# EAGLE design SilSpark (EAGLE 7.2.0)
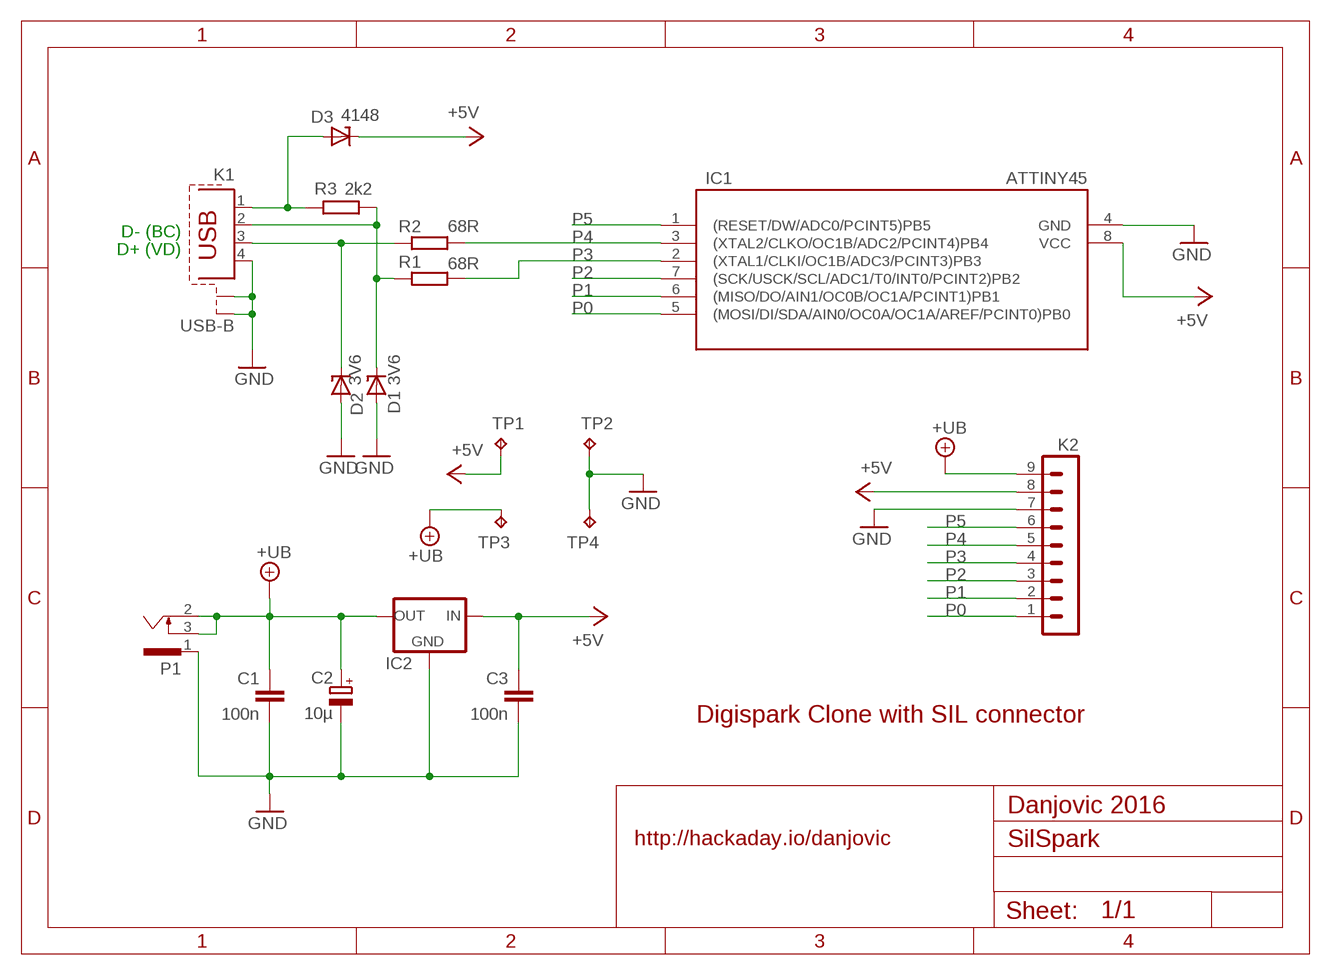
[diagram p0: schematic, sheet 1]

## Parts
C1  100n  C-EU050-025X075_LARGEPADS  [C050-025X075_LARGEPADS]
C2  10µ  CPOL-EUE2-4_LARGEPADS  [E2-4_LARGEPADS]
C3  100n  C-EU050-025X075_LARGEPADS  [C050-025X075_LARGEPADS]
D1  3V6  ZENER-DIODEZDIO-5_LARGEPADS  [ZDIO-5_LARGEPADS]
D2  3V6  ZENER-DIODEZDIO-5_LARGEPADS  [ZDIO-5_LARGEPADS]
D3  4148  ZENER-DIODEZDIO-5_LARGEPADS  [ZDIO-5_LARGEPADS]
IC1  ATTINY45  ATTINY45-20P  [DIL08]
IC2  78LXXFLAT  [VREG-TO90FLAT]
K1  USB-B  PN61729-SLARGEPADS  [PN61729-S_LARGEPADS]
K2  MA09-1W  [MA09-1W]
P1  733989-5  [733989-5]
R1  68R  R-EU_0207/7_LARGEPADS  [0204/7_LARGEPADS]
R2  68R  R-EU_0207/7_LARGEPADS  [0204/7_LARGEPADS]
R3  2k2  R-EU_0207/7_LARGEPADS  [0204/7_LARGEPADS]
TP1  TPPAD1-13  [P1-13]
TP2  TPPAD1-13  [P1-13]
TP3  TPPAD1-13  [P1-13]
TP4  TPPAD1-13  [P1-13]

## Nets
+5V: C3.1 D3.C IC1.8(VCC) IC2.IN K2.8 TP1.TP
+UB: C1.1 C2.+ IC2.OUT K2.9 P1.2 P1.3 TP3.TP
D+: D2.C K1.3 R2.2
D-: D1.C K1.2 R1.2 R3.2
GND: C1.2 C2.- C3.2 D1.A D2.A IC1.4(GND) IC2.GND K1.4 K1.S1 K1.S2 K2.7 P1.1 TP2.TP TP4.TP
N$3: D3.A K1.1 R3.1
P0: IC1.5((MOSI/DI/SDA/AIN0/OC0A/OC1A/AREF/PCINT0)PB0) K2.1
P1: IC1.6((MISO/DO/AIN1/OC0B/OC1A/PCINT1)PB1) K2.2
P2: IC1.7((SCK/USCK/SCL/ADC1/T0/INT0/PCINT2)PB2) K2.3
P3: IC1.2((XTAL1/CLKI/OC1B/ADC3/PCINT3)PB3) K2.4 R1.1
P4: IC1.3((XTAL2/CLKO/OC1B/ADC2/PCINT4)PB4) K2.5 R2.1
P5: IC1.1((RESET/DW/ADC0/PCINT5)PB5) K2.6

## Notes on the sheet
- D- (BC)
- D+ (VD)
- Digispark Clone with SIL connector
- Danjovic 2016
- http://hackaday.io/danjovic

## Library data of the parts
C1 C3 = rcl:C-EU: CAPACITOR, European symbol
C2 = rcl:CPOL-EU: POLARIZED CAPACITOR, European symbol
D1-D3 = diode:ZENER-DIODE: Z-Diode
IC1 = avr:ATTINY45: MICROCONTROLLER 4 Kbytes FLASH 256 bytes EEPROM 256 bytes RAM 4-channel 10 bit ADC USI
IC2 = diversos2:78LXX: VOLTAGE REGULATOR
K1 = con-berg:PN61729-S: BERG USB connector
K2 = con-lstb:MA09-1W: PIN HEADER; OC_FARNELL: unknown; OC_NEWARK: unknown
P1 = con-conrad:73398?: FEMALE PRINT CONNECTOR Niedervolt-Steckverbinder Distributor Conrad
R1-R3 = rcl:R-EU_: RESISTOR, European symbol
TP1-TP4 = testpad:TP: Test pad

## Board
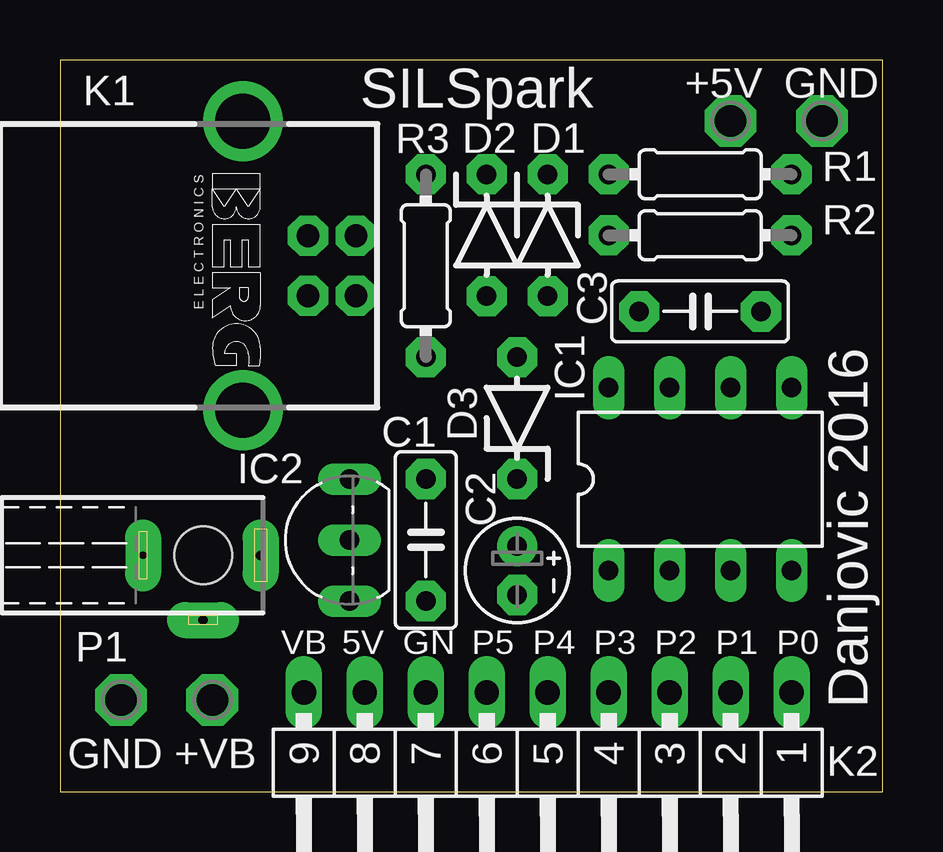
[diagram p1: board, top side]
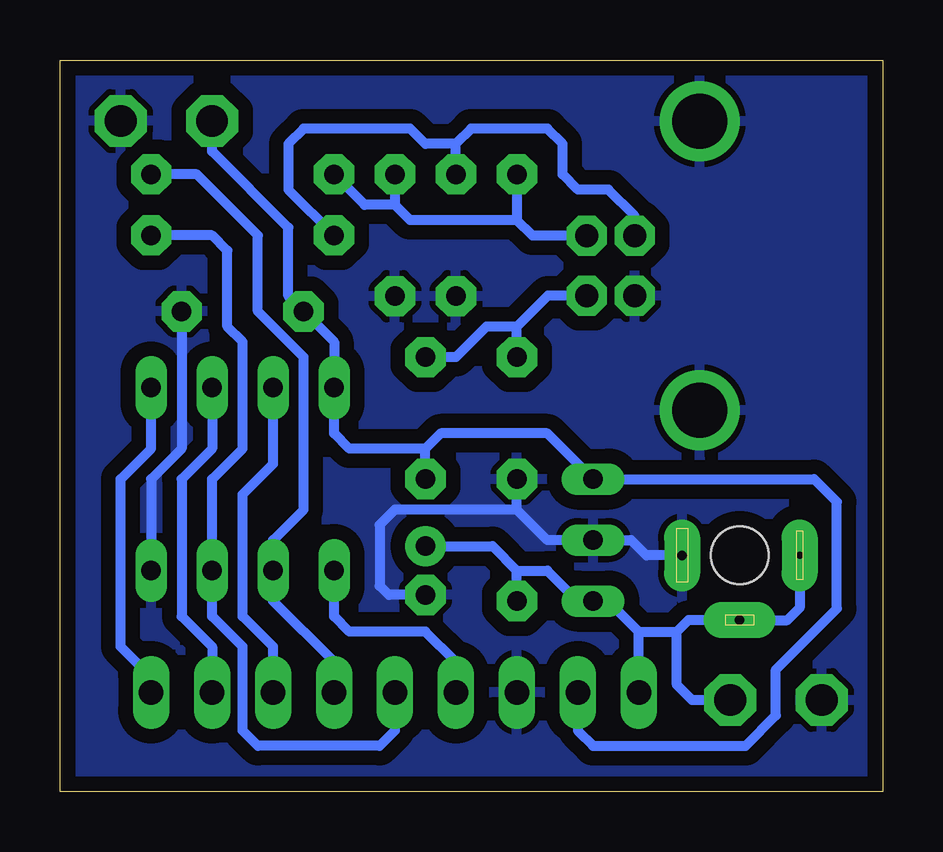
[diagram p2: board, bottom side, seen from below]

Size 34.28 x 30.48 mm. Coordinates in mm from the lower left corner, seen from the top.
Outline: 0,0 34.28,0 34.28,30.47 0.64,30.47 0,30.48 0,0
Copper layers (1*16): Top 0.035mm / dielectric 1.5mm / Bottom 0.035mm
Design rules "default *": minimum track width 10mil, minimum drill 24mil, track to track 8mil, track to pad 8mil, pad to pad 8mil, via to via 8mil, smd to smd 8mil, copper to edge 25mil, drill to drill 8mil, minimum pad ring 10mil, minimum via ring 8mil, stop-mask expansion 4mil, vias tented up to drill 0mil, thermal gap 10mil

### Footprints (pad centres in the part's own frame; a part is rotated, then mirrored left to right if it is on the bottom)
C050-025X075_LARGEPADS = drill 0.813 pad 1.676 octagon: 1 -2.54,0; 2 2.54,0
E2-4_LARGEPADS = drill 0.813 pad 1.676: + -1.016,0 | drill 0.813 pad 1.676 octagon: - 1.016,0
ZDIO-5_LARGEPADS = drill 0.813 pad 1.676 octagon: A 2.54,0; C -2.54,0
DIL08 = drill 0.813 long: 1 -3.81,-3.81; 2 -1.27,-3.81; 3 1.27,-3.81; 4 3.81,-3.81; 5 3.81,3.81; 6 1.27,3.81; 7 -1.27,3.81; 8 -3.81,3.81
VREG-TO90FLAT = drill 0.813 long: GND 0,0; IN 2.54,0; OUT -2.54,0
PN61729-S_LARGEPADS = drill 0.95 pad 1.676 octagon: 1 1.25,4.71; 2 -1.25,4.71; 3 -1.25,2.71; 4 1.25,2.71 | drill 2.3 pad 2.9: S1 -6.02,0; S2 6.02,0
MA09-1W = drill 1.016 long: 1 -10.16,0; 2 -7.62,0; 3 -5.08,0; 4 -2.54,0; 5 0,0; 6 2.54,0; 7 5.08,0; 8 7.62,0; 9 10.16,0
733989-5 = drill 0.4 pad 1.5 long: 1 0,5.82; 3 2.7,3.42 | drill 0.3 pad 1.5 long: 2 0,0.92 | hole 2.4: 0,3.42
0204/7_LARGEPADS = drill 0.813 pad 1.676 octagon: 1 -3.81,0; 2 3.81,0
P1-13 = drill 1.321 pad 2.159 octagon: TP 0,0

### Placement (x,y rotation side)
C1  15.24,10.48 90 top
C2  19.05,9.21 270 top
C3  26.67,20 0 top
D1  20.32,23.18 270 top
D2  17.78,23.18 270 top
D3  19.05,15.56 90 top
IC1  26.67,13.02 0 top
IC2  12.06,10.48 90 top
K1  7.62,21.91 270 top
K2  20.32,4.13 180 top
P1  2.54,9.84 270 top
R1  26.67,25.72 180 top
R2  26.67,23.18 180 top
R3  15.24,21.91 90 top
TP1  27.94,27.94 0 top
TP2  31.75,27.94 0 top
TP3  6.35,3.81 0 top
TP4  2.54,3.81 0 top

### Tracks (layer width: path | path; a pad name or v marks a point on that pad's centre or on a via)
+5V
  Bottom 0.406: 19.05,14.29 18.41,14.92 13.97,14.92 IC2.IN 2.86,13.02 1.91,12.06 1.91,7.62 4.45,5.08 4.45,3.17 5.71,1.91 12.06,1.91 12.7,2.54 K2.8 | 19.05,14.29 22.23,14.29 22.86,14.92 IC1.8 22.86,18.73 C3.1 24.77,20.64 24.77,23.5 27.94,26.67 TP1.TP | D3.C 19.05,14.29
+UB
  Bottom 0.406: P1.2 3.46,7.65 3.97,7.14 P1.3 8.1,7.14 8.57,6.67 | K2.9 10.16,6.67 | 10.16,6.67 11.43,7.94 IC2.OUT 12.7,7.94 13.97,9.21 15.24,9.21 | C2.+ 16.26,10.22 15.24,9.21 | 10.16,6.67 8.57,6.67 | C1.1 15.24,9.21 | TP3.TP 7.94,3.81 8.57,4.45 8.57,6.67
D+
  Bottom 0.406: 17.78,26.99 17.14,27.62 13.97,27.62 13.34,26.99 13.34,25.72 12.7,25.08 11.43,25.08 10.33,23.98 K1.3 | 17.78,26.99 19.05,26.99 19.68,27.62 24.13,27.62 24.77,26.99 24.77,25.08 R2.2 | D2.C 17.78,26.99
D-
  Bottom 0.406: K1.2 14.59,23.16 15.24,23.81 | 15.24,23.81 19.68,23.81 20.32,24.45 | 20.32,24.45 21.59,24.45 R1.2 | D1.C 20.32,24.45 | R3.2 15.24,23.81
GND
  Bottom 0.406: C3.2 29.21,14.29 30.48,13.02 IC1.4 | 15.24,11.75 13.97,10.48 IC2.GND 10.48,10.48 9.84,9.84 P1.1 | 15.24,11.75 C1.2 | 15.24,11.75 20.32,11.75 20.95,11.11 20.95,8.57 20.57,8.19 C2.-
  pour Bottom (isolate 0.61): 0,30.48 0,0 34.29,0 34.29,30.48
N$3
  Bottom 0.406: 15.24,19.37 16.51,19.37 17.78,18.1 D3.A | R3.1 15.24,19.37 | K1.1 13.95,20.66 15.24,19.37
P0
  Bottom 0.406: K2.1 30.48,4.76 31.75,6.03 31.75,13.02 30.48,14.29 IC1.5
P1
  Bottom 0.406: IC1.6 27.94,14.29 29.21,13.02 29.21,7.3 27.94,6.03 K2.2
P2
  Bottom 0.406: K2.3 25.4,6.03 26.67,7.3 26.67,12.38 25.4,13.65 IC1.7
P3
  Bottom 0.406: K2.4 22.86,5.4 25.4,7.94 IC1.2 25.4,10.48 24.13,11.75 24.13,18.1 26.04,20 26.04,23.18 28.57,25.72 R1.1
P4
  Bottom 0.406: K2.5 20.32,2.54 20.95,1.91 26.04,1.91 26.67,2.54 26.67,6.03 27.94,7.3 IC1.3 27.94,13.02 26.67,14.29 26.67,18.73 27.3,19.37 27.3,22.54 27.94,23.18 R2.1
P5
  Bottom 0.406: K2.6 17.78,5.4 19.05,6.67 22.23,6.67 22.86,7.3 IC1.1

### Text on the board
tPlace: SILSpark | +5V | GND | Danjovic 2016 | GND | +VB
tNames: VB | 5V | GN | P5 | P4 | P3 | P2 | P1 | P0